# Altium schematic sheet Slice.SchDoc
size A4; SheetNumber: 1; SheetTotal: 1
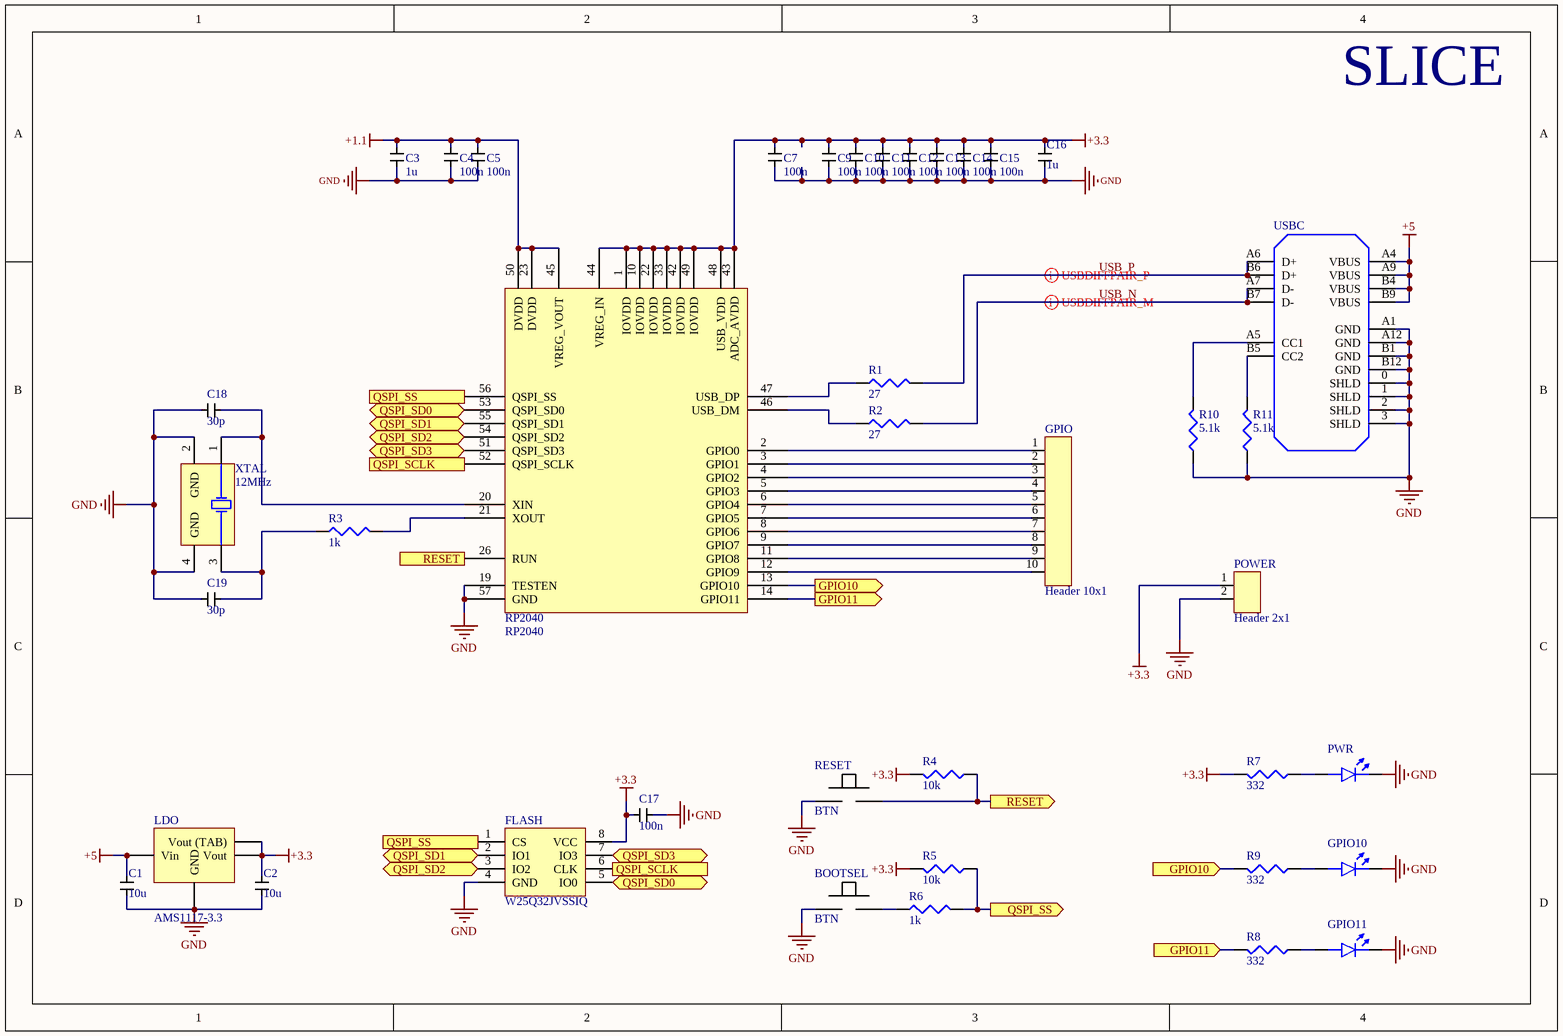
[diagram p0: Slice.SchDoc]

## Parts
BOOTSEL  BTN  [TS1088AR02016]
C1  10u  [C0402]
C2  10u  [C0402]
C3  1u  [C0402]
C4  100n  [C0402]
C5  100n  [C0402]
C7  100n  [C0402]
C9  100n  [C0402]
C10  100n  [C0402]
C11  100n  [C0402]
C12  100n  [C0402]
C13  100n  [C0402]
C14  100n  [C0402]
C15  100n  [C0402]
C16  1u  [C0402]
C17  100n  [C0402]
C18  30p  [C0402]
C19  30p  [C0402]
FLASH  W25Q32JVSSIQ  [SOIC8N]
GPIO  Header 10x1  [HEADER10x1]
GPIO10  LED  [LED0603P]  (value not drawn)
GPIO11  LED  [LED0603P]  (value not drawn)
LDO  AMS1117-3.3  [SOT-223]
POWER  Header 2x1  [HEADER2X1]
PWR  LED  [LED0603P]  (value not drawn)
R1  27  [R0402]
R2  27  [R0402]
R3  1k  [R0402]
R4  10k  [R0402]
R5  10k  [R0402]
R6  1k  [R0402]
R7  332  [R0402]
R8  332  [R0402]
R9  332  [R0402]
R10  5.1k  [R0402]
R11  5.1k  [R0402]
RESET  BTN  [TS1088AR02016]
RP2040  RP2040  [RP2040]
USBC  USBC  [USB-TYPE-C-018]  (value not drawn)
XTAL  12MHz  [TSX-3225]

## Ports
GPIO10 (in), GPIO10 (out), GPIO11 (in), GPIO11 (out), QSPI_SCLK (in), QSPI_SCLK (out), QSPI_SD0 (bidir), QSPI_SD1 (bidir), QSPI_SD2 (bidir), QSPI_SD3 (bidir), QSPI_SS (in), QSPI_SS (out), RESET (in), RESET (out)

## Nets
+1.1: C3.2 C4.2 C5.2 RP2040.23(DVDD) RP2040.45(VREG_VOUT) RP2040.50(DVDD)
+3.3: C2.2 C7.2 C9.2 C10.2 C11.2 C12.2 C13.2 C14.2 C15.2 C16.2 C17.2 FLASH.8(VCC) LDO.3(Vout) LDO.4(Vout_(TAB)) POWER.1 R4.2 R5.2 R7.2 RP2040.1(IOVDD) RP2040.10(IOVDD) RP2040.22(IOVDD) RP2040.33(IOVDD) RP2040.42(IOVDD) RP2040.43(ADC_AVDD) RP2040.44(VREG_IN) RP2040.48(USB_VDD) RP2040.49(IOVDD)
+5: C1.2 LDO.2(Vin) USBC.A4(VBUS) USBC.A9(VBUS) USBC.B4(VBUS) USBC.B9(VBUS)
GND: BOOTSEL.1 C1.1 C2.1 C3.1 C4.1 C5.1 C7.1 C9.1 C10.1 C11.1 C12.1 C13.1 C14.1 C15.1 C16.1 C17.1 C18.2 C19.2 FLASH.4(GND) GPIO10.2(K) GPIO11.2(K) LDO.1(GND) POWER.2 PWR.2(K) R10.1 R11.1 RESET.1 RP2040.19(TESTEN) RP2040.57(GND) USBC.0(SHLD) USBC.1(SHLD) USBC.2(SHLD) USBC.3(SHLD) USBC.A1(GND) USBC.A12(GND) USBC.B1(GND) USBC.B12(GND) XTAL.2(GND) XTAL.4(GND)
GPIO10: R9.2 RP2040.13(GPIO10) ; port GPIO10
GPIO11: R8.2 RP2040.14(GPIO11) ; port GPIO11
QSPI_SCLK: FLASH.6(CLK) RP2040.52(QSPI_SCLK) ; port QSPI_SCLK
QSPI_SD0: FLASH.5(IO0) RP2040.53(QSPI_SD0) ; port QSPI_SD0
QSPI_SD1: FLASH.2(IO1) RP2040.55(QSPI_SD1) ; port QSPI_SD1
QSPI_SD2: FLASH.3(IO2) RP2040.54(QSPI_SD2) ; port QSPI_SD2
QSPI_SD3: FLASH.7(IO3) RP2040.51(QSPI_SD3) ; port QSPI_SD3
QSPI_SS: FLASH.1(CS) R5.1 R6.2 RP2040.56(QSPI_SS) ; port QSPI_SS
RESET: R4.1 RESET.2 RP2040.26(RUN) ; port RESET
USB_N: R2.2 USBC.A7(D-) USBC.B7(D-)
USB_P: R1.2 USBC.A6(D+) USBC.B6(D+)
NetBOOTSEL_2: BOOTSEL.2 R6.1
NetC18_1: C18.1 RP2040.20(XIN) XTAL.1(X1)
NetC19_1: C19.1 R3.1 XTAL.3(X2)
NetGPIO10_1: GPIO10.1(A) R9.1
NetGPIO11_1: GPIO11.1(A) R8.1
NetGPIO_1: GPIO.1 RP2040.2(GPIO0)
NetGPIO_2: GPIO.2 RP2040.3(GPIO1)
NetGPIO_3: GPIO.3 RP2040.4(GPIO2)
NetGPIO_4: GPIO.4 RP2040.5(GPIO3)
NetGPIO_5: GPIO.5 RP2040.6(GPIO4)
NetGPIO_6: GPIO.6 RP2040.7(GPIO5)
NetGPIO_7: GPIO.7 RP2040.8(GPIO6)
NetGPIO_8: GPIO.8 RP2040.9(GPIO7)
NetGPIO_9: GPIO.9 RP2040.11(GPIO8)
NetGPIO_10: GPIO.10 RP2040.12(GPIO9)
NetPWR_1: PWR.1(A) R7.1
NetR1_1: R1.1 RP2040.47(USB_DP)
NetR2_1: R2.1 RP2040.46(USB_DM)
NetR3_2: R3.2 RP2040.21(XOUT)
NetR10_2: R10.2 USBC.A5(CC1)
NetR11_2: R11.2 USBC.B5(CC2)

## Layout directives
differential pair: USB_N, USB_P

## Notes on the sheet
- SLICE

## Library data of the parts
C1-C5 C7 C9-C19 = C
FLASH = FLASH
LDO = LDO
R1-R11 = R
XTAL = XTAL